# Altium project marsohodAudio.PrjPcb
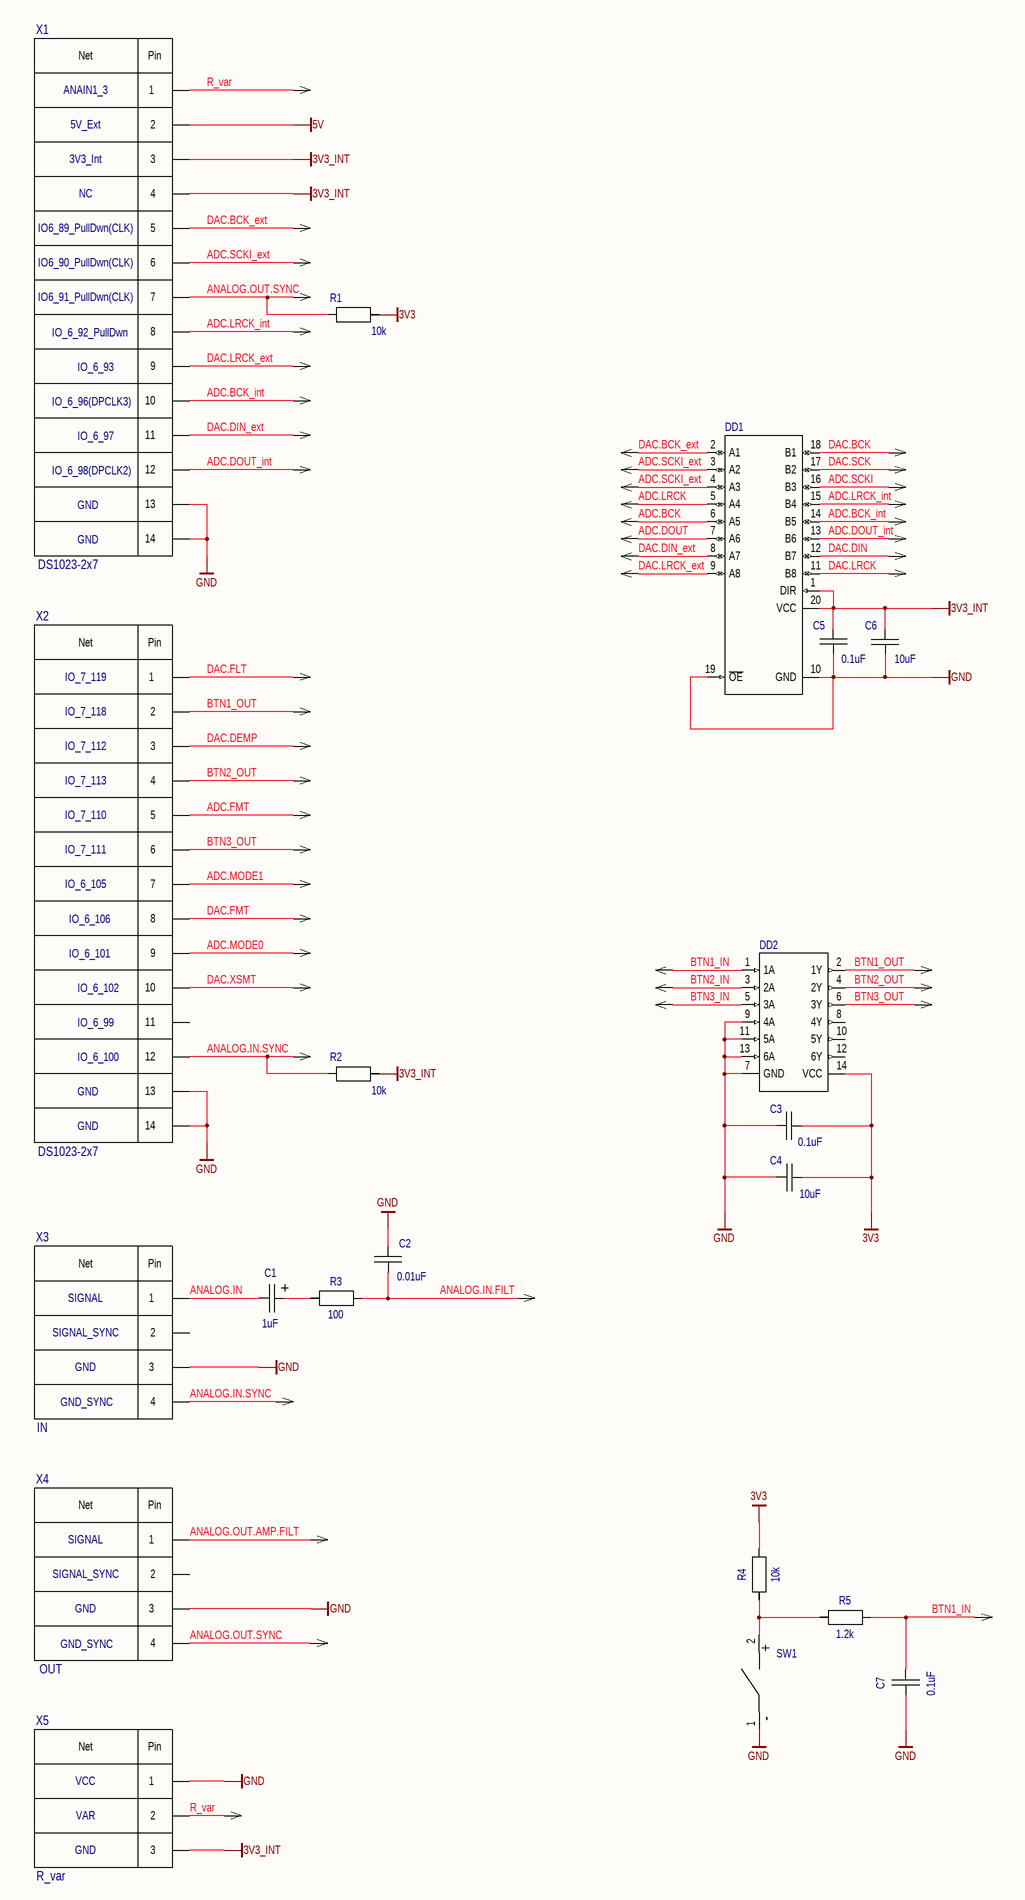
[diagram p0: scheme.SchDoc, left]
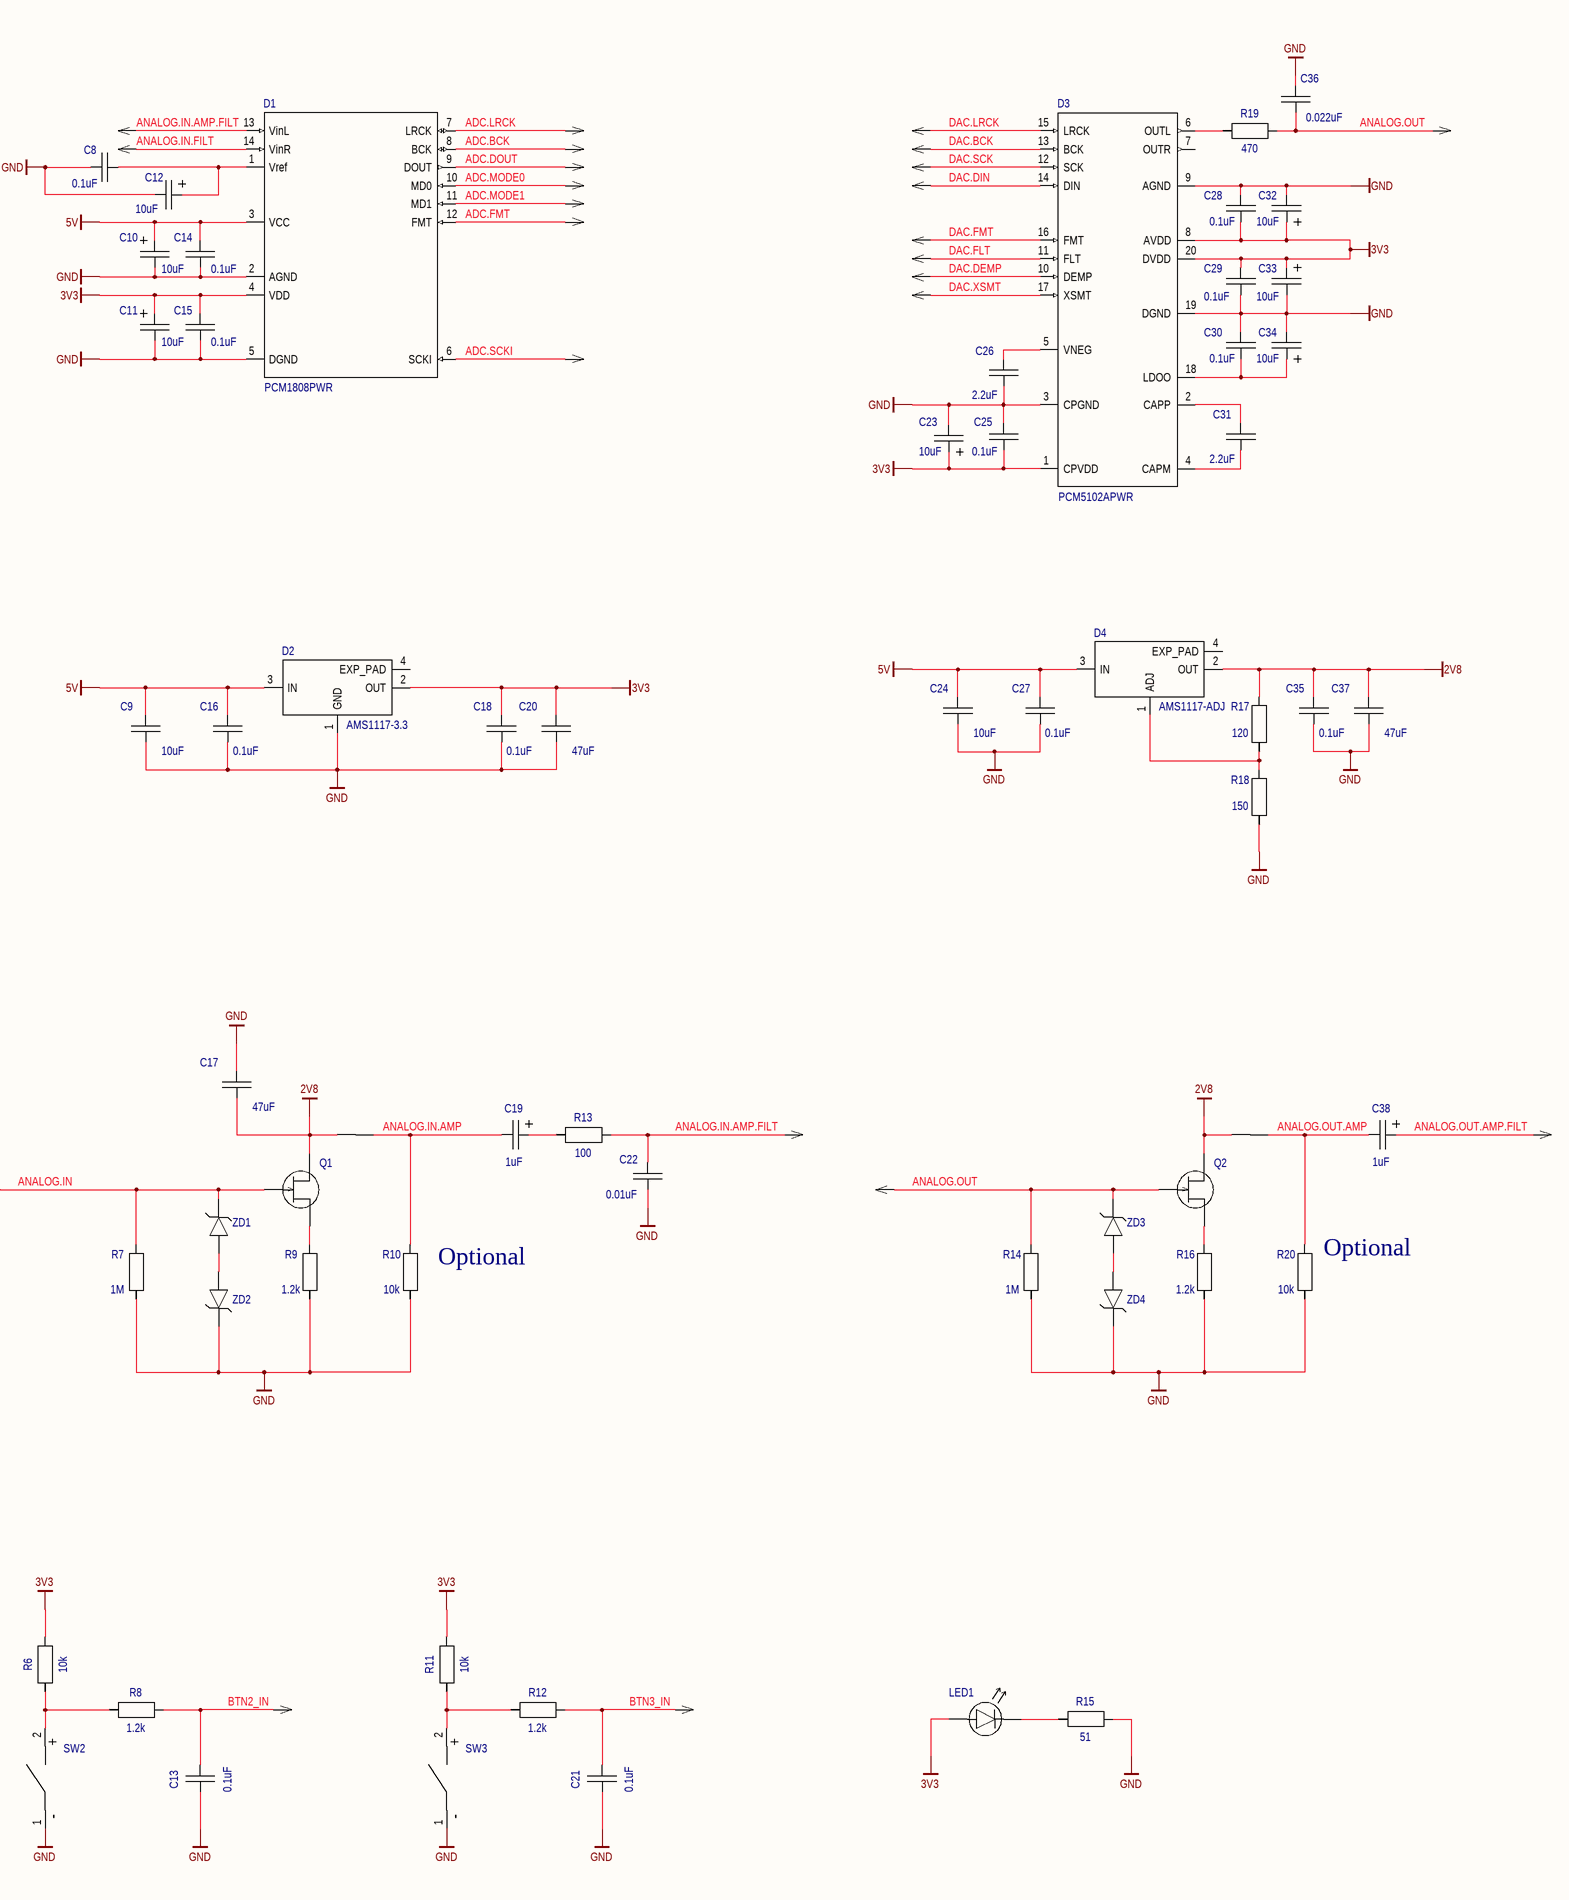
[diagram p1: scheme.SchDoc, right]
1 sheet, 81 parts. Net scope: global (net labels, ports and power ports of the same name join across sheets).
Board file: PCB.PcbDoc

## Sheet scheme.SchDoc
size A1; NormInspection: Нормокнтрль; ProcessInspection: Технолог; Scale: Мш; DocumentType: Тип схемы; Letter1Column: Литера; Pervich_primen: ВЕИР.464512.701; PageSetup: Record=PageOptions|CenterHorizontal=True|CenterVertical=True|PrintScale=1.00|XCorrection=1.00|YCorrection=1.00|PrintKind=1|BorderSize=5000000|LeftOffset=0|BottomOffset=0|Orientation=2|PaperLength=1000|PaperWidth=1000|Scale=100|PaperSource=15|PrintQuality=1200|MediaType=1|DitherType=10|PaperKind=A3|PrintScaleMode=1; Обозначение: ВЕИР.464512.701; DocumentType1: Схема электрическая; DocumentType2: принципиальная; Title2: Плата Bluetooth модуля; Organization: Protel International P/L; Address1: L3, 12a Rodborough Rd; Address2: Frenchs Forest; Address3: NSW; Address4: Australia 2086

### Parts
C1  1uF  [SMD_CAP_4x5.4]
C2  0.01uF  [C0805]
C3  0.1uF  [C1206]
C4  10uF  [C1206]
C5  0.1uF  [C1206]
C6  10uF  [C1206]
C7  0.1uF  [C1206]
C8  0.1uF  [C1206]
C9  10uF  [C1206]
C10  10uF  [SMD_CAP_4x5.4]
C11  10uF  [SMD_CAP_4x5.4]
C12  10uF  [SMD_CAP_4x5.4]
C13  0.1uF  [C1206]
C14  0.1uF  [C1206]
C15  0.1uF  [C1206]
C16  0.1uF  [C1206]
C17  47uF  [C1210]
C18  0.1uF  [C1206]
C19  1uF  [SMD_CAP_4x5.4]
C20  47uF  [C1210]
C21  0.1uF  [C1206]
C22  0.01uF  [C0805]
C23  10uF  [SMD_CAP_4x5.4]
C24  10uF  [C1206]
C25  0.1uF  [C1206]
C26  2.2uF  [C1206]
C27  0.1uF  [C1206]
C28  0.1uF  [C1206]
C29  0.1uF  [C1206]
C30  0.1uF  [C1206]
C31  2.2uF  [C1206]
C32  10uF  [SMD_CAP_4x5.4]
C33  10uF  [SMD_CAP_4x5.4]
C34  10uF  [SMD_CAP_4x5.4]
C35  0.1uF  [C1206]
C36  0.022uF  [C1206]
C37  47uF  [C1210]
C38  1uF  [SMD_CAP_4x5.4]
D1  PCM1808PWR  [TSSOP-14]
D2  AMS1117-3.3  [SOT223]
D3  PCM5102APWR  [SSOP-20]
D4  AMS1117-ADJ  [SOT223]
DD1  8-ch transceiver  [SOIC-20]  (value not drawn)
DD2  SCHMITT-TRIGGER INVERTER  [SOIC-14]  (value not drawn)
LED1  KP-2012SEC  [2.0x1.25mm_SMD_CHIP_LED]  (value not drawn)
NT1  NetTie  [0805_NetTie]  (value not drawn)  (net tie, no BOM)
NT2  NetTie  [0805_NetTie]  (value not drawn)  (net tie, no BOM)
Q1  J201  [SOT23]  (value not drawn)
Q2  J201  [SOT23]  (value not drawn)
R1  10k  [R2512]
R2  10k  [R2512]
R3  100  [R2512]
R4  10k  [R2512]
R5  1.2k  [R2512]
R6  10k  [R2512]
R7  1M  [R0805]
R8  1.2k  [R2512]
R9  1.2k  [R2512]
R10  10k  [R2512]
R11  10k  [R2512]
R12  1.2k  [R2512]
R13  100  [R2512]
R14  1M  [R0805]
R15  51  [R2512]
R16  1.2k  [R2512]
R17  120  [R2512]
R18  150  [R2512]
R19  470  [R2512]
R20  10k  [R2512]
SW1  simple_button  [BUTTON_template]  (value not drawn)
SW2  simple_button  [BUTTON_template]  (value not drawn)
SW3  simple_button  [BUTTON_template]  (value not drawn)
X1  DS1023-2x7  9: IO_6_93  14: GND  12: IO_6_98(DPCLK2)  11: IO_6_97  10: IO_6_96(DPCLK3)  8: IO_6_92_PullDwn  1: ANAIN1_3  2: 5V_Ext  3: 3V3_Int  4: NC  5: IO6_89_PullDwn(CLK)  6: IO6_90_PullDwn(CLK)  7: IO6_91_PullDwn(CLK)  [DS1023-2x7]
X2  DS1023-2x7  9: IO_6_101  14: GND  12: IO_6_100  11: IO_6_99  10: IO_6_102  8: IO_6_106  1: IO_7_119  2: IO_7_118  3: IO_7_112  4: IO_7_113  5: IO_7_110  6: IO_7_111  7: IO_6_105  [DS1023-2x7]
X3  IN  1: SIGNAL  2: SIGNAL_SYNC  4: GND_SYNC  3: GND  [NYS_2152_6.35mm]
X4  OUT  1: SIGNAL  2: SIGNAL_SYNC  4: GND_SYNC  3: GND  [NYS_2152_6.35mm]
X5  R_var  1: VCC  2: VAR  3: GND  [PTD90]
ZD1  1N4733A  [DO-41]  (value not drawn)
ZD2  1N4733A  [DO-41]  (value not drawn)
ZD3  1N4733A  [DO-41]  (value not drawn)
ZD4  1N4733A  [DO-41]  (value not drawn)

### Nets
2V8: C17.1 C35.2 C37.2 D4.2(OUT) NT1.1 NT2.1 Q1.1(D) Q2.1(D) R17.2
3V3: C3.2 C4.2 C11.1(Pos) C15.2 C18.2 C20.2 C23.1(Pos) C25.1 C28.2 C29.2 C32.1(Pos) C33.1(Pos) D1.4(VDD) D2.2(OUT) D3.1(CPVDD) D3.8(AVDD) D3.20(DVDD) DD2.14(VCC) LED1.1(A) R1.1 R4.2 R6.2 R11.2
3V3_INT: C5.2 C6.2 DD1.1(DIR) DD1.20(VCC) R2.1 X1.3 X1.4 X5.3
5V: C9.2 C10.1(Pos) C14.2 C16.2 C24.2 C27.2 D1.3(VCC) D2.3(IN) D4.3(IN) X1.2
GND: C2.2 C3.1 C4.1 C5.1 C6.1 C7.1 C8.1 C9.1 C10.2(Neg) C11.2(Neg) C12.2(Neg) C13.1 C14.1 C15.1 C16.1 C17.2 C18.1 C20.1 C21.1 C22.1 C23.2(Neg) C24.1 C25.2 C26.1 C27.1 C28.1 C29.1 C30.1 C32.2(Neg) C33.2(Neg) C34.2(Neg) C35.1 C36.2 C37.1 D1.2(AGND) D1.5(DGND) D2.1(GND) D3.3(CPGND) D3.9(AGND) D3.19(DGND) DD1.10(GND) DD1.19(~{OE}) DD2.7(GND) DD2.9(4A) DD2.11(5A) DD2.13(6A) R7.1 R9.1 R10.1 R14.1 R15.2 R16.1 R18.1 R20.1 SW1.1 SW2.1 SW3.1 X1.13 X1.14 X2.13 X2.14 X3.3 X4.3 X5.1 ZD2.2(C) ZD4.2(C)
ADC.BCK: D1.8(BCK) DD1.6(A5)
ADC.BCK_int: DD1.14(B5) X1.10
ADC.DOUT: D1.9(DOUT) DD1.7(A6)
ADC.DOUT_int: DD1.13(B6) X1.12
ADC.FMT: D1.12(FMT) X2.5
ADC.LRCK: D1.7(LRCK) DD1.5(A4)
ADC.LRCK_int: DD1.15(B4) X1.8
ADC.MODE0: D1.10(MD0) X2.9
ADC.MODE1: D1.11(MD1) X2.7
ADC.SCKI: D1.6(SCKI) DD1.16(B3)
ADC.SCKI_ext: DD1.3(A2) DD1.4(A3) X1.6
ANALOG.IN: C1.2(Neg) Q1.3(G) R7.2 X3.1 ZD1.2(C)
ANALOG.IN.AMP: C19.2(Neg) NT1.2 R10.2
ANALOG.IN.AMP.FILT: C22.2 D1.13(VinL) R13.2
ANALOG.IN.FILT: C2.1 D1.14(VinR) R3.2
ANALOG.IN.SYNC: R2.2 X2.12 X3.4
ANALOG.OUT: C36.1 Q2.3(G) R14.2 R19.2 ZD3.2(C)
ANALOG.OUT.AMP: C38.2(Neg) NT2.2 R20.2
ANALOG.OUT.AMP.FILT: C38.1(Pos) X4.1
ANALOG.OUT.SYNC: R1.2 X1.7 X4.4
BTN1_IN: C7.2 DD2.1(1A) R5.2
BTN1_OUT: DD2.2(1Y) X2.2
BTN2_IN: C13.2 DD2.3(2A) R8.2
BTN2_OUT: DD2.4(2Y) X2.4
BTN3_IN: C21.2 DD2.5(3A) R12.2
BTN3_OUT: DD2.6(3Y) X2.6
DAC.BCK: D3.13(BCK) DD1.18(B1)
DAC.BCK_ext: DD1.2(A1) X1.5
DAC.DEMP: D3.10(DEMP) X2.3
DAC.DIN: D3.14(DIN) DD1.12(B7)
DAC.DIN_ext: DD1.8(A7) X1.11
DAC.FLT: D3.11(FLT) X2.1
DAC.FMT: D3.16(FMT) X2.8
DAC.LRCK: D3.15(LRCK) DD1.11(B8)
DAC.LRCK_ext: DD1.9(A8) X1.9
DAC.SCK: D3.12(SCK) DD1.17(B2)
DAC.XSMT: D3.17(XSMT) X2.10
R_var: X1.1 X5.2
NetC1_1: C1.1(Pos) R3.1
NetC8_2: C8.2 C12.1(Pos) D1.1(Vref)
NetC19_1: C19.1(Pos) R13.1
NetC26_2: C26.2 D3.5(VNEG)
NetC30_2: C30.2 C34.1(Pos) D3.18(LDOO)
NetC31_1: C31.1 D3.4(CAPM)
NetC31_2: C31.2 D3.2(CAPP)
NetD3_6: D3.6(OUTL) R19.1
NetD4_1: D4.1(ADJ) R17.1 R18.2
NetLED1_2: LED1.2(C) R15.1
NetQ1_2: Q1.2(S) R9.2
NetQ2_2: Q2.2(S) R16.2
NetR4_1: R4.1 R5.1 SW1.2
NetR6_1: R6.1 R8.1 SW2.2
NetR11_1: R11.1 R12.1 SW3.2
NetZD1_1: ZD1.1(A) ZD2.1(A)
NetZD3_1: ZD3.1(A) ZD4.1(A)

Not connected (* = marked no-connect by the designer): D2 4(EXP_PAD); D3 7(OUTR); D4 4(EXP_PAD); DD2 8(4Y) 10(5Y) 12(6Y); X2 11; X3 2; X4 2

### Notes on the sheet
- (near R10) Optional
- (near R20) Optional
- Title
- Size:
- Date:
- File:
- A1
- Number:
- Time:
- Revision:
- Sheet
- of
- (in symbol NYS_2152_6.35mm) Net; Pin
- (in symbol PBD-14 (DS1023-2x7)) Net; Pin
- (in symbol Rvar_blank) Net; Pin
- (in symbol simple_button) +; -

### Library data of the parts
C1 C19 C38 = JCK1H010M040054: ECAP SMD, 1 uF, 50V, 105°C, 20% 4x5.4mm; Model: *; Other: *; Value: 1uF
C2 C22 = GRM2195C1H103J: 0.01 uF NPO 50V 5% 0805; Model: *; Other: *; Value: 0.01uF
C3 C5 C7 C8 C13-C16 C18 C21 C25 C27-C30 C35 = GRM319R72A104KA01D: SMD 0.1 uF X7R 10%100V 1206; Model: *; Other: *; Value: 0.1uF
C4 C6 C9 C24 = GRM31CR71E106KA12L*: SMD 10 uF X7R 10% 25V 1206; Model: *; Other: *; Value: 10uF
C10-C12 C23 C32-C34 = JCK1E100M040054: ECAP SMD, 10uF, 25 V, 105°C, 20% 4x5.4mm; Model: *; Other: *; Value: 10uF
C17 C20 C37 = GRM32ER61C476KE15K: SMD 1210 X5R 47uF 16V 10%; Model: *; Other: *; Value: 47uF
C26 C31 = GRM31CR71H225KA88**L: SMD 2.2мкФ,X7R 50В, 10%, 1206; Model: *; Other: *; Value: 2.2uF
C36 = GRM319R71H223KA01D: SMD 0.022uF X7R 50V 10% 1206 (22nF); Model: *; Other: *; Value: 0.022uF
D2 = AMS1117_3.3
DD1 = SN74LVC245ADW
DD2 = SN74HC14D
R1 R2 R4 R6 R10 R11 R20 = RC0805FR-0710KL: Model: RC0805FR; Other: *; Value: 10k
R3 R13 = RC2512JR-07100RL: Model: RC2512JR; Other: *; Value: 100
R5 R8 R9 R12 R16 = RC2512FR-071K2L: Model: RC2512FR; Other: *; Value: 1.2k
R7 R14 = RC0805JR-071ML: Model: RC0805JR; Other: *; Value: 1M
R15 = RC2512JR-0751RL: Model: RC2512JR; Other: *; Value: 51
R17 = RC2512FR-07120RL: Model: RC2512FR; Other: *; Value: 120
R18 = RC2512FR-07150RL: Model: RC2512FR; Other: *; Value: 150
R19 = RC2512FR-07470RL: Model: RC2512FR; Other: *; Value: 470
X1 X2 = PBD-14 (DS1023-2x7): 13: GND
X3 X4 = NYS_2152_6.35mm: Jack 6.35mm MONO
X5 = Rvar_blank